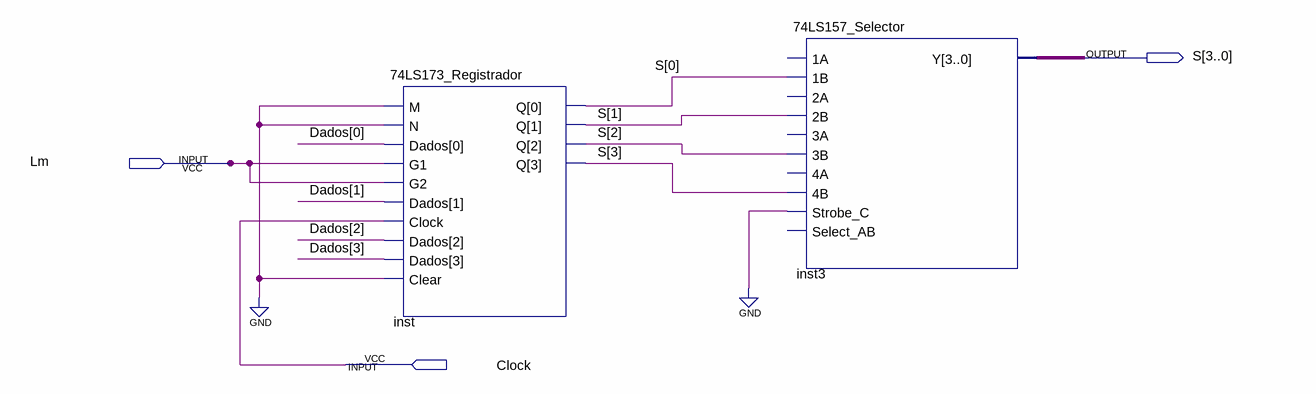
[diagram p0: schematic sheet]
// Quartus schematic MAR.bdf as structural Verilog: 2 symbols, 3 pins
module MAR (
  input  Lm,
  input  Clock,
  output [3:0] S
);

  wire [3:0] Dados;

  \74LS173_Registrador  inst (.M(1'b0), .N(1'b0), .Dados(Dados), .G1(Lm), .G2(Lm), .Clock(Clock), .Clear(1'b0), .Q(S));
  \74LS157_Selector  inst3 (
    .\1B (S[0]), .\2B (S[1]), .\3B (S[2]), .\4B (S[3]), .Strobe_C(1'b0), .Y(S));  // open: 1A, 2A, 3A, 4A, Select_AB
endmodule
